# Altium schematic sheet Level_Shifter.SchDoc
size A4; SheetNumber: 8; SheetTotal: 8
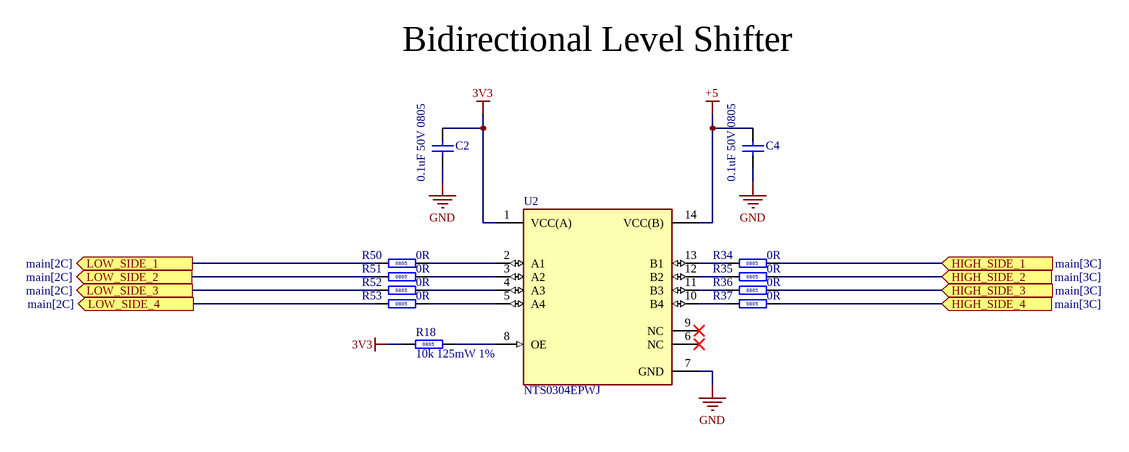
[diagram p0: Level_Shifter.SchDoc]

## Parts
C2  0.1uF 50V 0805  [CAPC2012X14N]
C4  0.1uF 50V 0805  [CAPC2012X14N]
R18  10k 125mW 1%  [RESC2013X60X35LL10T20]
R34  0R  [Copy of RESC2013X60X35NL10T20]
R35  0R  [Copy of RESC2013X60X35NL10T20]
R36  0R  [Copy of RESC2013X60X35NL10T20]
R37  0R  [Copy of RESC2013X60X35NL10T20]
R50  0R  [Copy of RESC2013X60X35NL10T20]
R51  0R  [Copy of RESC2013X60X35NL10T20]
R52  0R  [Copy of RESC2013X60X35NL10T20]
R53  0R  [Copy of RESC2013X60X35NL10T20]
U2  NTS0304EPWJ  [FP-SOT402-1-MFG]

## Ports
HIGH_SIDE_1 (in, see main[3C]), HIGH_SIDE_2 (in, see main[3C]), HIGH_SIDE_3 (in, see main[3C]), HIGH_SIDE_4 (in, see main[3C]), LOW_SIDE_1 (out, see main[2C]), LOW_SIDE_2 (out, see main[2C]), LOW_SIDE_3 (out, see main[2C]), LOW_SIDE_4 (out, see main[2C])

## Nets
3V3: C2.2 R18.1 U2.1(VCC(A))
+5: C4.2 U2.14(VCC(B))
GND: C2.1 C4.1 U2.7(GND)
HIGH_SIDE_1: R34.2 ; port HIGH_SIDE_1
HIGH_SIDE_2: R35.2 ; port HIGH_SIDE_2
HIGH_SIDE_3: R36.2 ; port HIGH_SIDE_3
HIGH_SIDE_4: R37.2 ; port HIGH_SIDE_4
LOW_SIDE_1: R50.1 ; port LOW_SIDE_1
LOW_SIDE_2: R51.1 ; port LOW_SIDE_2
LOW_SIDE_3: R52.1 ; port LOW_SIDE_3
LOW_SIDE_4: R53.1 ; port LOW_SIDE_4
NetR18_2: R18.2 U2.8(OE)
NetR34_1: R34.1 U2.13(B1)
NetR35_1: R35.1 U2.12(B2)
NetR36_1: R36.1 U2.11(B3)
NetR37_1: R37.1 U2.10(B4)
NetR50_2: R50.2 U2.2(A1)
NetR51_2: R51.2 U2.3(A2)
NetR52_2: R52.2 U2.4(A3)
NetR53_2: R53.2 U2.5(A4)

Not connected (* = marked no-connect by the designer): U2 6(NC)* 9(NC)*

## Notes on the sheet
- Bidirectional Level Shifter

## Library data of the parts
C2 C4 = CMP-40-005-00117-1: Cap, SMD, 0.1uF, 50V, 10%, 0805, X7R; Manufacturer: Samsung; ManufacturerPartNumber: CL21B104KBCWPNC; CapacitorType: Ceramic; Value: 100nF; ComponentLinkDescription: Datasheet; Package: 0805; MountingType: SMD; VoltageRating: 50V; Tolerance: 10%; ComponentLinkURL: https://octopart.com/part/samsung-electro-mechanics/CL21B104KBCWPNC; DielectricType: Ceramic
R18 = CMP-40-025-00226-1: Res, SMD, 10k, 125mW, 1%, ±200ppm, 0805; Manufacturer: Panasonic; ManufacturerPartNumber: ERJ-6GEYJ103V; Package Height: 0.6mm; ComponentLinkDescription: Datasheet; Voltage Rating: 150V; Tolerance: 5%; RoHS3Certificate: https://download.siliconexpert.com/pdfs2/2024/6/2/9/59/48/925943/pns_/manual/erj6enf2700v_rohs.pdf; Composition: Thick Film; Contact Plating: Tin; Reach SVHC Compliant: Unaffected; ComponentLinkURL: https://octopart.com/erj-6geyj103v-panasonic-55422885; Temperature Coefficient (ppm/cel): ±200ppm; Resistance: 10k; Max Operating Temperature: 155°C; Mount: SMD; Number of Pins: 2; Case/Package: 0805; RoHS3Compliant: Yes (with exeption); Power Rating: 125mW; Resistor Type: Fixed; Min Operating Temperature: -55°C
R34-R37 R50-R53 = CMP-40-025-00156-5: Res, SMD, 0R, 0.125W, 1%, 0805; Manufacturer: Yageo; ManufacturerPartNumber: RC0805JR-070RL; ComponentLinkDescription: Datasheet; Package Height: 0.5mm; PowerRating: 125mW; Package Length: 2mm; Value: 0; Rated Temperature: 70°C; Package Width: 1.25mm; Termination: Wraparound; Mounting Technology: Surface Mount; Resistor Type: FIXED RESISTOR; MountingType: SMD; Max Operating Temperature: 155°C; Construction: Chip; RoHS Compliant: Yes; Power: 125mW; Tolerance: 1%; Packaging: Tape and Reel; Pins: 2; Min Operating Temperature: -55°C; Package: 0805; Terminal Finish: Nickel; Package Style: SMTMeter; Case/Package: 0805; Package Shape: Rectangular; ComponentLinkURL: https://datasheet.ciiva.com/pdfs/VipMasterIC/IC/YAGO/YAGO-S-A0008145938/YAGO-S-A0008145938-1.pdf?src-supplier=IHS+Markit; Minimum Operating Temperature: -55°C; Technology: METAL GLAZE/THICK FILM; JESD-609 Code: e3; Maximum Operating Temperature: 155°C; Reach SVHC Compliant: Yes
U2 = CMP-10125-000002-1: 4-BIT VOLTAGE TRANSLATOR 14TSSOP; Manufacturer: NXP; Number Of Circuits: 4; Logic Function Desc: Translating Transceiver; Data Rate: 20Mbits/s; Standoff Height: 0.05mm; Min Supply Voltage: 0.95V; Nominal Supply Current: 2.2-18uA; V A Max: 4.6V; Max Supply Voltage: 5.5V; Max Junction Temp: +85°C; V B Min: -0.5V; V B Max: 6.5V; Propagation Delay: 5.3ns; Package: SOT402-1; Device Class L1: Integrated Circuits (ICs); Temperature Range High: +85°C; Number Of Outputs: 4; Temperature: -40°C to +85°C; Category: IC; Octopart: https://octopart.com/nts0304epwj-nxp+semiconductors-97865291; Ambient Temperature Range High: +125°C; Automotive: No; Device Class L3: Voltage Level Shifters; Digikey Description: 4-BIT VOLTAGE TRANSLATOR 14TSSOP; RoHS: TRUE; Lead Free: Yes; Manufacturer Part Number: NTS0304EPWJ; ComponentLink2Description: Datasheet; Number Of Inputs: 4; Footprint Url: https://www.nxp.com/docs/en/package-information/SOT402-1.pdf; Ambient Temperature Range Low: -40°C; Temperature Range Low: -40°C; V A Min: -0.5V; ComponentLink2URL: https://www.nxp.com/docs/en/data-sheet/NTS0304E.pdf; Device Class L2: Logic ICs; Height: 1.1mm